# Altium schematic sheet PG03_ECG.SchDoc: Smart Ring (Concept)
size B; DocumentNumber: 3; SheetNumber: 3; SheetTotal: 3
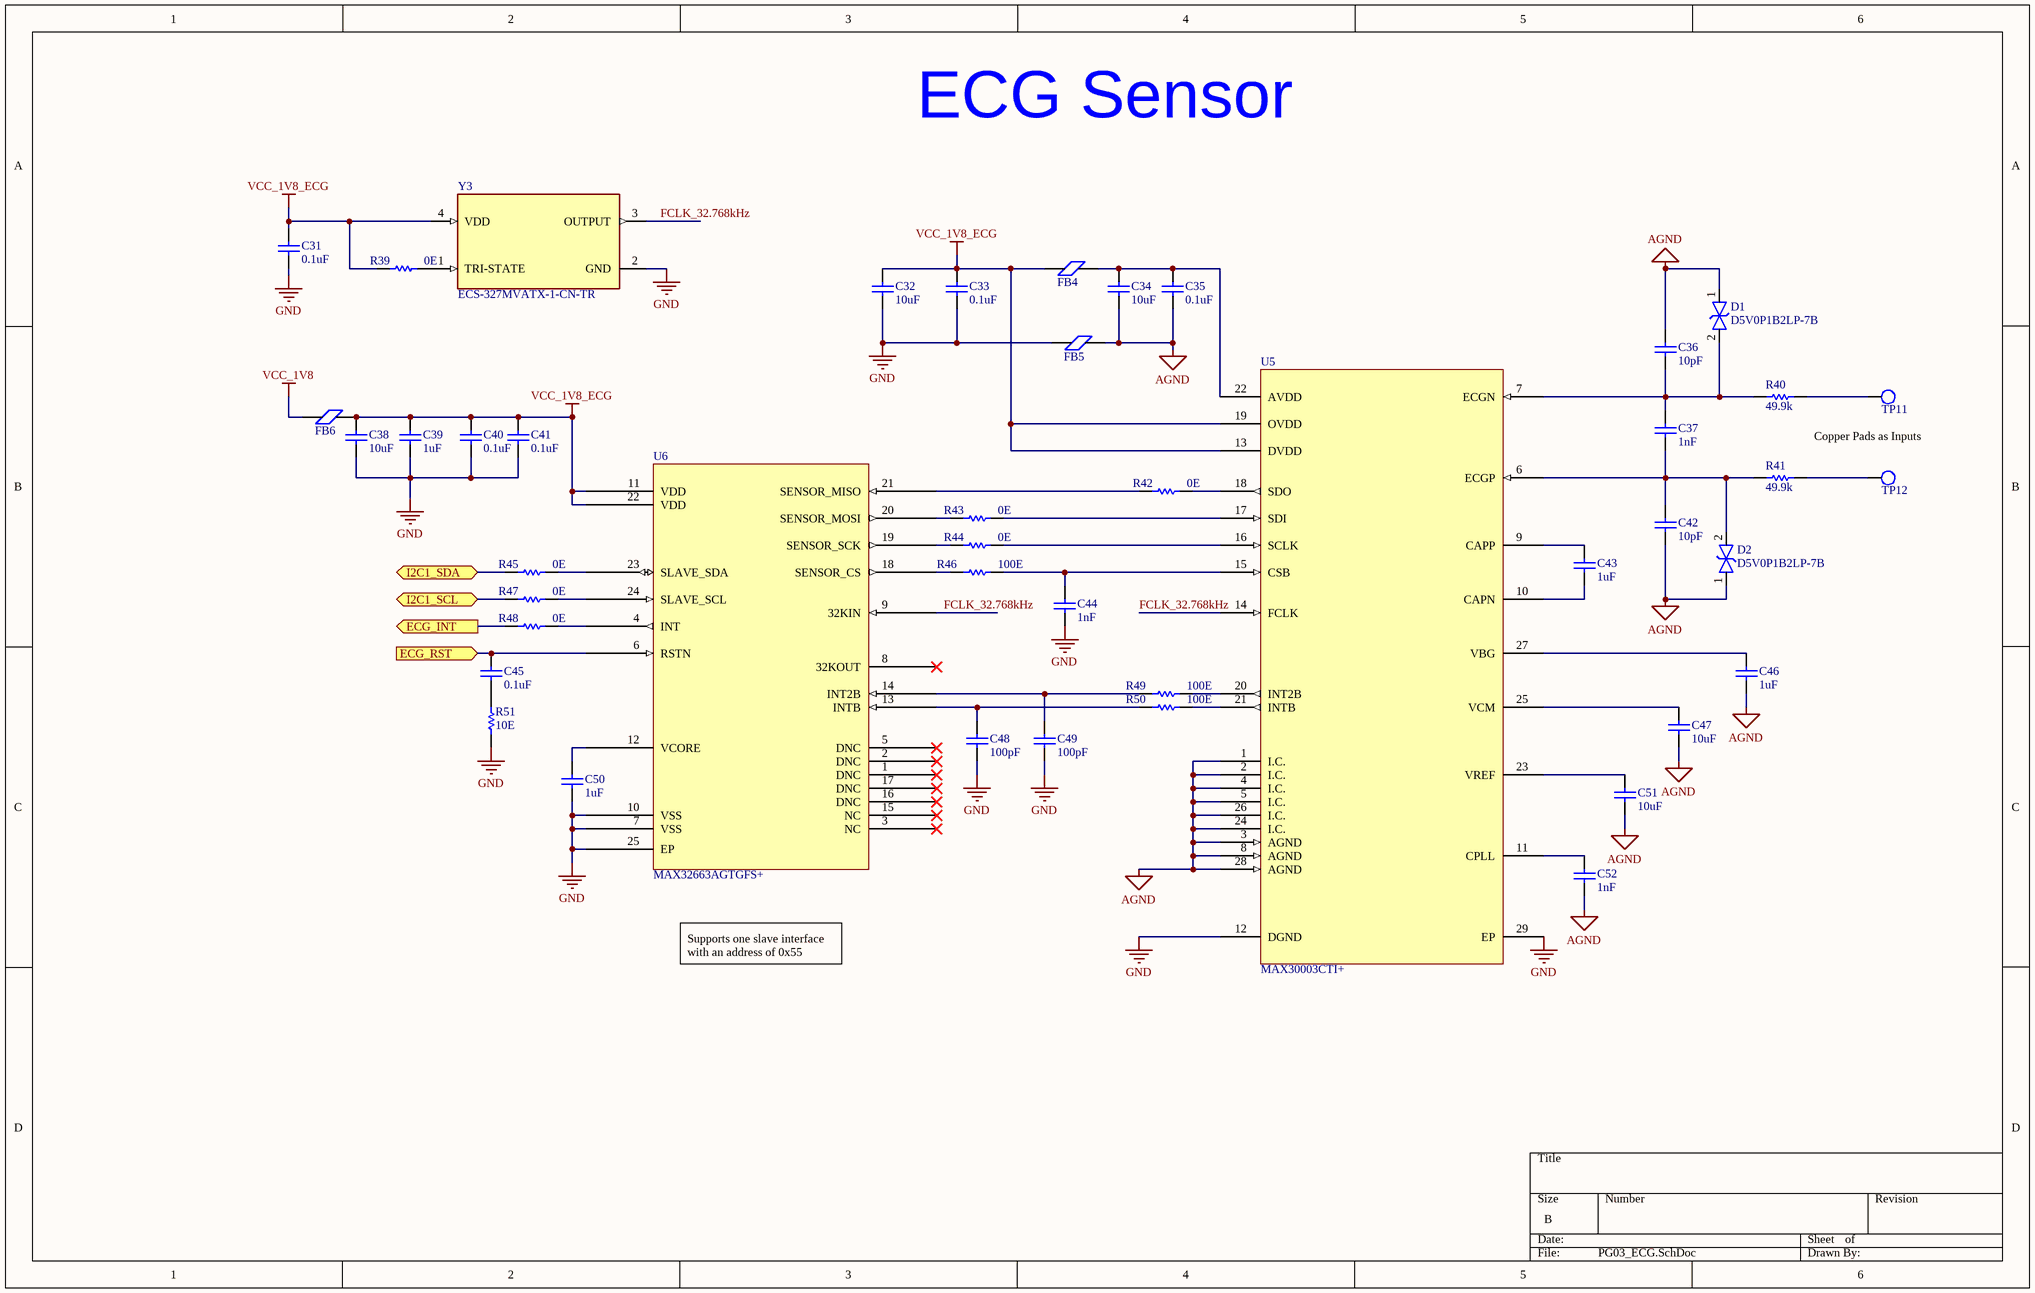
[diagram p0: PG03_ECG.SchDoc]

## Parts
C31  0.1uF  [0402C]
C32  10uF  [0805C]
C33  0.1uF  [0402C]
C34  10uF  [0805C]
C35  0.1uF  [0402C]
C36  10pF  [0402C]
C37  1nF  [0402C]
C38  10uF  [0805C]
C39  1uF  [0805C]
C40  0.1uF  [0402C]
C41  0.1uF  [0402C]
C42  10pF  [0402C]
C43  1uF  [0805C]
C44  1nF  [0402C]
C45  0.1uF  [0402C]
C46  1uF  [0805C]
C47  10uF  [0805C]
C48  100pF  [0402C]
C49  100pF  [0402C]
C50  1uF  [0805C]
C51  10uF  [0805C]
C52  1nF  [0402C]
D1  D5V0P1B2LP-7B  [D5V0P1B2LP-7B]
D2  D5V0P1B2LP-7B  [D5V0P1B2LP-7B]
FB4  Ferrite Bead  [0402R]  (value not drawn)
FB5  Ferrite Bead  [0402R]  (value not drawn)
FB6  Ferrite Bead  [0402R]  (value not drawn)
R39  0E  [0402R]
R40  49.9k  [0402R]
R41  49.9k  [0402R]
R42  0E  [0402R]
R43  0E  [0402R]
R44  0E  [0402R]
R45  0E  [0402R]
R46  100E  [0402R]
R47  0E  [0402R]
R48  0E  [0402R]
R49  100E  [0402R]
R50  100E  [0402R]
R51  10E  [0402R]
TP11  Test_Point  [TP_SMD]  (value not drawn)
TP12  Test_Point  [TP_SMD]  (value not drawn)
U5  MAX30003CTI+  [MAX30003CTI+]
U6  MAX32663AGTGFS+  [MAX32663AGTGFS+]
Y3  ECS-327MVATX-1-CN-TR  [ECS-327MVATX-1-CN-TR]

## Ports
ECG_INT (out), ECG_RST (in), I2C1_SCL (bidir), I2C1_SDA (bidir)

## Nets
AGND: C34.1 C35.1 C36.2 C42.1 C46.1 C47.1 C51.1 C52.1 D1.1 D2.1 FB5.2(VREF) U5.1(I.C.) U5.2(I.C.) U5.3(AGND) U5.4(I.C.) U5.5(I.C.) U5.8(AGND) U5.24(I.C.) U5.26(I.C.) U5.28(AGND)
GND: C31.1 C32.1 C33.1 C38.1 C39.1 C40.1 C41.1 C44.1 C48.1 C49.1 C50.1 FB5.1(VREF) R51.1 U5.12(DGND) U5.29(EP) U6.7(VSS) U6.10(VSS) U6.25(EP) Y3.2(GND)
VCC_1V8: FB6.2(VREF)
VCC_1V8_ECG: C31.2 C32.2 C33.2 C38.2 C39.2 C40.2 C41.2 FB4.2(VREF) FB6.1(VREF) R39.1 U5.13(DVDD) U5.19(OVDD) U6.11(VDD) U6.22(VDD) Y3.4(VDD)
ECG_INT: R48.1 ; port ECG_INT
ECG_RST: C45.2 U6.6(RSTN) ; port ECG_RST
FCLK_32.768kHz: U5.14(FCLK) U6.9(32KIN) Y3.3(OUTPUT)
I2C1_SCL: R47.1 ; port I2C1_SCL
I2C1_SDA: R45.1 ; port I2C1_SDA
NetC34_2: C34.2 C35.2 FB4.1(VREF) U5.22(AVDD)
NetC36_1: C36.1 C37.2 D1.2 R40.1 U5.7(ECGN)
NetC37_1: C37.1 C42.2 D2.2 R41.1 U5.6(ECGP)
NetC43_1: C43.1 U5.10(CAPN)
NetC43_2: C43.2 U5.9(CAPP)
NetC44_2: C44.2 R46.2 U5.15(CSB)
NetC45_1: C45.1 R51.2
NetC46_2: C46.2 U5.27(VBG)
NetC47_2: C47.2 U5.25(VCM)
NetC48_2: C48.2 R50.1 U6.13(INTB)
NetC49_2: C49.2 R49.1 U6.14(INT2B)
NetC50_2: C50.2 U6.12(VCORE)
NetC51_2: C51.2 U5.23(VREF)
NetC52_2: C52.2 U5.11(CPLL)
NetR39_2: R39.2 Y3.1(TRI-STATE)
NetR40_2: R40.2 TP11.1
NetR41_2: R41.2 TP12.1
NetR42_1: R42.1 U6.21(SENSOR_MISO)
NetR42_2: R42.2 U5.18(SDO)
NetR43_1: R43.1 U6.20(SENSOR_MOSI)
NetR43_2: R43.2 U5.17(SDI)
NetR44_1: R44.1 U6.19(SENSOR_SCK)
NetR44_2: R44.2 U5.16(SCLK)
NetR45_2: R45.2 U6.23(SLAVE_SDA)
NetR46_1: R46.1 U6.18(SENSOR_CS)
NetR47_2: R47.2 U6.24(SLAVE_SCL)
NetR48_2: R48.2 U6.4(INT)
NetR49_2: R49.2 U5.20(INT2B)
NetR50_2: R50.2 U5.21(INTB)

Not connected (* = marked no-connect by the designer): U6 1(DNC)* 2(DNC)* 3(NC)* 5(DNC)* 8(32KOUT)* 15(NC)* 16(DNC)* 17(DNC)*

## Notes on the sheet
- ECG Sensor
- Copper Pads as Inputs
- Supports one slave interface with an address of 0x55

## Library data of the parts
C31 C33 C35 C40 C41 C45 = CAP_0402_0.1uF_50V: CAP CER 0.1UF 50V X7R 0402; Alternate MFR: Samsung Electro-Mechanics; Alternate MPN: CL05B104KB54PNC; Package: 0402; Value: 0.1uF
C32 C34 C38 C47 C51 = CAP_0805_10uF_16V: CAP CER 10UF 16V X7R 0805; Alternate MFR: Taiyo Yuden; Alternate MPN: EMK212BB7106MG-T; Package: 0805; Value: 10uF
C36 C42 = CAP_0402_10pF_50V: CAP CER 10PF 50V C0G/NP0 0402; Alternate MFR: Murata Electronics; Alternate MPN: GRT1555C1H100JA02J; Package: 0402; Value: 10pF
C37 C44 C52 = CAP_0402_1nF_50V: CAP CER 1000PF 50V X7R 0402; Alternate MFR: TDK Corporation; Alternate MPN: C1005X7R1H102K050BA; Package: 0402; Value: 1nF
C39 C43 C46 C50 = CAP_0805_1uF_25V: CAP CER 1UF 25V X7R 0805; Alternate MFR: Würth Elektronik; Alternate MPN: 885012207078; Package: 0805; Value: 1uF
C48 C49 = CAP_0402_100pF_50V: CAP CER 100PF 50V C0G 0402; Alternate MFR: TDK Corporation; Alternate MPN: C1005C0G1H101J050BA; Package: 0402; Value: 100pF
D1 D2 = TVS_D5V0P1B2LP-7B: TVS DIODE 5.5VWM 13VC DFN1006-2; MFR: Diodes Incorporated; MPN: D5V0P1B2LP-7B; Package: X1-DFN1006-2
FB4-FB6 = Ferrite Bead: CHIP BEAD 600 OHM 0402 300mA; MFR: Walsin; MPN: WLBD1005K2U601TP; Package: 0402
R39 R42-R45 R47 R48 = RES_0402_0E: RES 0 OHM JUMPER 1/16W 0402; MFR: Generic; Alternate MFR: YAGEO; Alternate MPN: AC0402JR-130RL; MPN: Generic; Package: 0402; Value: 0E
R40 R41 = RES_0402_49.9k: RES 49.9K OHM 1% 1/16W 0402; MFR: Generic; Alternate MFR: YAGEO; Alternate MPN: RC0402FR-0749K9L; MPN: Generic; Package: 0402; Value: 49.9k
R46 R49 R50 = RES_0402_100E: RES 100 OHM 1% 1/16W 0402; MFR: Generic; Alternate MFR: YAGEO; Alternate MPN: RC0402FR-13100RL; MPN: Generic; Package: 0402; Value: 100E
R51 = RES_0402_10E: RES 10 OHM 1% 1/16W 0402; MFR: Generic; Alternate MFR: YAGEO; Alternate MPN: RC0402FR-1310RL; MPN: Generic; Package: 0402; Value: 10E
TP11 TP12 = Test_Point_1
U5 = MAX30003CTI+: Analog Front End - AFE Bio Potential AFE; MFR: Maxim Integrated; MPN: MAX30003CTI+; Package: 28-TQFN (5X5)
U6 = MAX32663AGTGFS+: SENSOR HUB W/ B-SECUR'S FULL HEA; MFR: Maxim Integrated; MPN: MAX32663AGTGFS+; Package: 24-TQFN (3x3)
Y3 = OSC_32.768kHz: XTAL OSC XO 32.768KHZ SMD; MFR: ECS Inc.; MPN: ECS-327MVATX-1-CN-TR; Package: 4-SMD, No Lead; Value: *